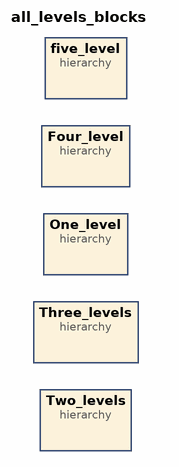
[diagram p0: block diagram of the top level]
# Vivado block design all_levels_blocks, xc7z020clg400-1, Vivado 2025.2
create_bd_design all_levels_blocks

create_bd_cell -type hier Three_levels
create_bd_cell -type hier Two_levels
create_bd_cell -type hier One_level
create_bd_cell -type hier Four_level
create_bd_cell -type hier five_level

# ---- hierarchy /Three_levels ----
current_bd_instance /Three_levels
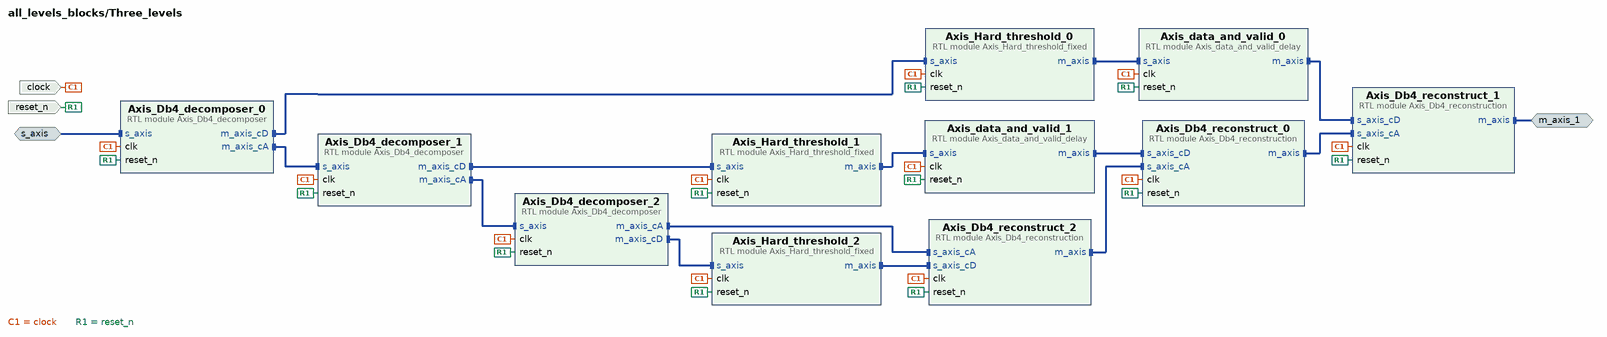
[diagram p1: block diagram inside /Three_levels]
create_bd_intf_pin -mode Slave -vlnv xilinx.com:interface:axis_rtl:1.0 s_axis
create_bd_intf_pin -mode Master -vlnv xilinx.com:interface:axis_rtl:1.0 m_axis_1
create_bd_pin -dir I -type clk clock
create_bd_pin -dir I -type rst reset_n

create_bd_cell -type module -reference Axis_Db4_decomposer Axis_Db4_decomposer_0
create_bd_cell -type module -reference Axis_data_and_valid_delay Axis_data_and_valid_0
set_property -dict {CONFIG.DATA_WIDTH 32 CONFIG.DELAY 74} [get_bd_cells Axis_data_and_valid_0]
create_bd_cell -type module -reference Axis_Db4_reconstruction Axis_Db4_reconstruct_0
set_property -dict {CONFIG.LEVEL 2} [get_bd_cells Axis_Db4_reconstruct_0]
create_bd_cell -type module -reference Axis_data_and_valid_delay Axis_data_and_valid_1
set_property -dict {CONFIG.DATA_WIDTH 32 CONFIG.DELAY 45} [get_bd_cells Axis_data_and_valid_1]
create_bd_cell -type module -reference Axis_Db4_decomposer Axis_Db4_decomposer_1
create_bd_cell -type module -reference Axis_Db4_decomposer Axis_Db4_decomposer_2
create_bd_cell -type module -reference Axis_Db4_reconstruction Axis_Db4_reconstruct_2
set_property -dict {CONFIG.LEVEL 3} [get_bd_cells Axis_Db4_reconstruct_2]
create_bd_cell -type module -reference Axis_Db4_reconstruction Axis_Db4_reconstruct_1
set_property -dict {CONFIG.LEVEL 1} [get_bd_cells Axis_Db4_reconstruct_1]
create_bd_cell -type module -reference Axis_Hard_threshold_fixed Axis_Hard_threshold_0
set_property -dict {CONFIG.THRESHOLD 5000} [get_bd_cells Axis_Hard_threshold_0]
create_bd_cell -type module -reference Axis_Hard_threshold_fixed Axis_Hard_threshold_1
set_property -dict {CONFIG.THRESHOLD 5000} [get_bd_cells Axis_Hard_threshold_1]
create_bd_cell -type module -reference Axis_Hard_threshold_fixed Axis_Hard_threshold_2
set_property -dict {CONFIG.THRESHOLD 5000} [get_bd_cells Axis_Hard_threshold_2]

# ---- hierarchy /Two_levels ----
current_bd_instance /Two_levels
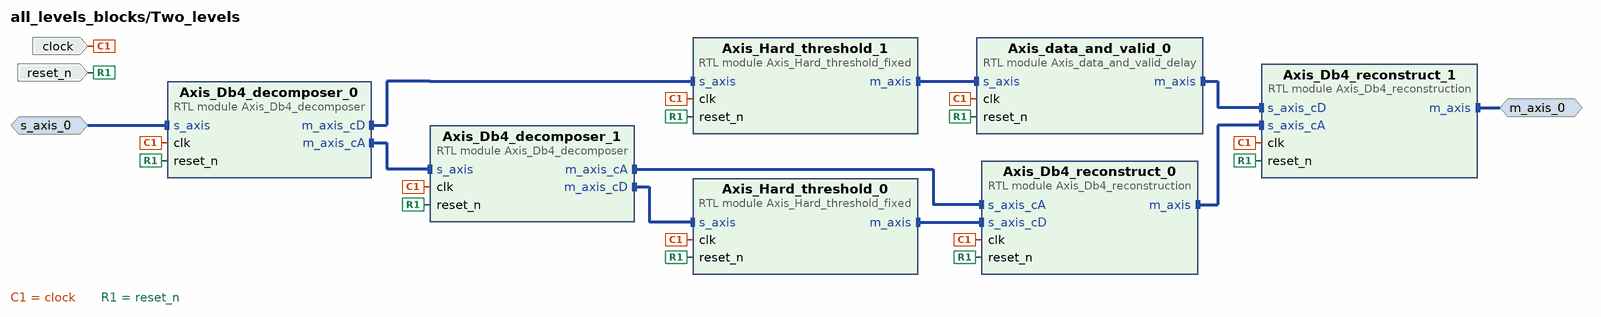
[diagram p2: block diagram inside /Two_levels]
create_bd_intf_pin -mode Slave -vlnv xilinx.com:interface:axis_rtl:1.0 s_axis_0
create_bd_intf_pin -mode Master -vlnv xilinx.com:interface:axis_rtl:1.0 m_axis_0
create_bd_pin -dir I clock
create_bd_pin -dir I -type rst reset_n

create_bd_cell -type module -reference Axis_Db4_decomposer Axis_Db4_decomposer_0
create_bd_cell -type module -reference Axis_data_and_valid_delay Axis_data_and_valid_0
set_property -dict {CONFIG.DATA_WIDTH 32 CONFIG.DELAY 29} [get_bd_cells Axis_data_and_valid_0]
create_bd_cell -type module -reference Axis_Db4_reconstruction Axis_Db4_reconstruct_0
set_property -dict {CONFIG.LEVEL 2} [get_bd_cells Axis_Db4_reconstruct_0]
create_bd_cell -type module -reference Axis_Db4_decomposer Axis_Db4_decomposer_1
create_bd_cell -type module -reference Axis_Db4_reconstruction Axis_Db4_reconstruct_1
set_property -dict {CONFIG.LEVEL 1} [get_bd_cells Axis_Db4_reconstruct_1]
create_bd_cell -type module -reference Axis_Hard_threshold_fixed Axis_Hard_threshold_0
set_property -dict {CONFIG.THRESHOLD 5000} [get_bd_cells Axis_Hard_threshold_0]
create_bd_cell -type module -reference Axis_Hard_threshold_fixed Axis_Hard_threshold_1
set_property -dict {CONFIG.THRESHOLD 5000} [get_bd_cells Axis_Hard_threshold_1]

# ---- hierarchy /One_level ----
current_bd_instance /One_level
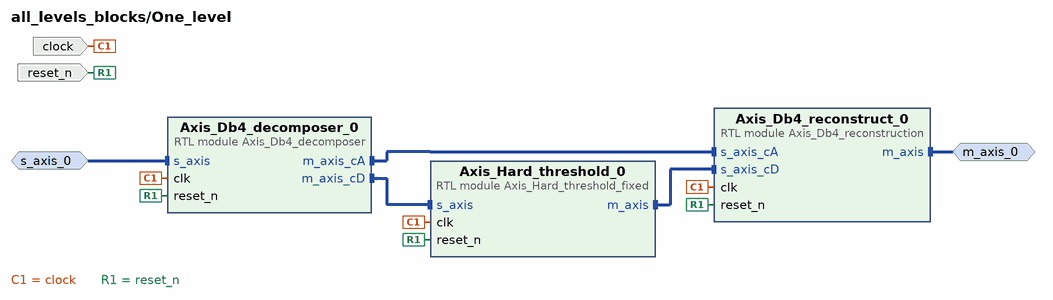
[diagram p3: block diagram inside /One_level]
create_bd_intf_pin -mode Slave -vlnv xilinx.com:interface:axis_rtl:1.0 s_axis_0
create_bd_intf_pin -mode Master -vlnv xilinx.com:interface:axis_rtl:1.0 m_axis_0
create_bd_pin -dir I clock
create_bd_pin -dir I -type rst reset_n

create_bd_cell -type module -reference Axis_Db4_decomposer Axis_Db4_decomposer_0
create_bd_cell -type module -reference Axis_Db4_reconstruction Axis_Db4_reconstruct_0
set_property -dict {CONFIG.LEVEL 1} [get_bd_cells Axis_Db4_reconstruct_0]
create_bd_cell -type module -reference Axis_Hard_threshold_fixed Axis_Hard_threshold_0
set_property -dict {CONFIG.THRESHOLD 5000} [get_bd_cells Axis_Hard_threshold_0]

# ---- hierarchy /Four_level ----
current_bd_instance /Four_level
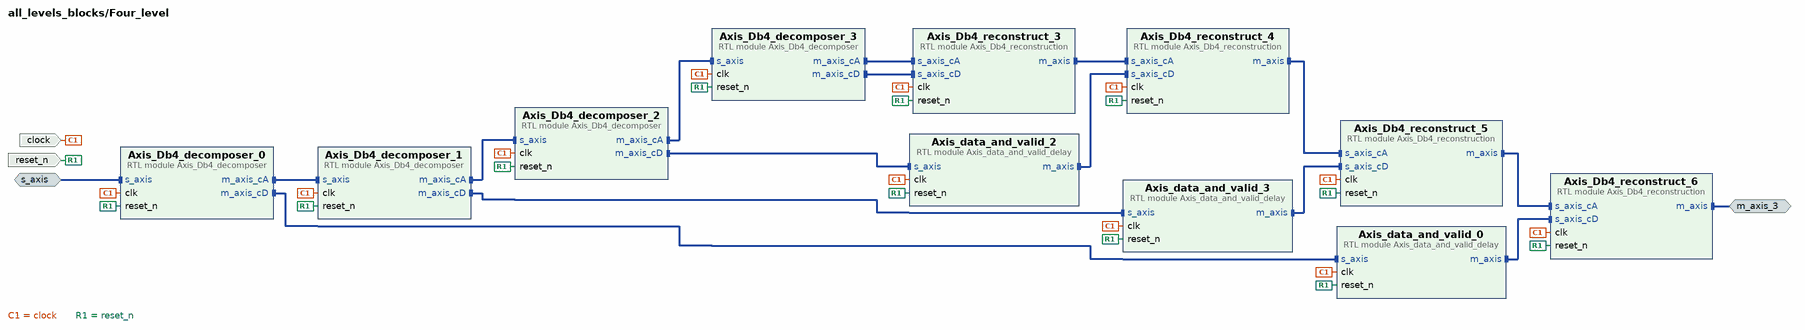
[diagram p4: block diagram inside /Four_level]
create_bd_intf_pin -mode Slave -vlnv xilinx.com:interface:axis_rtl:1.0 s_axis
create_bd_intf_pin -mode Master -vlnv xilinx.com:interface:axis_rtl:1.0 m_axis_3
create_bd_pin -dir I -type clk clock
create_bd_pin -dir I -type rst reset_n

create_bd_cell -type module -reference Axis_Db4_decomposer Axis_Db4_decomposer_0
create_bd_cell -type module -reference Axis_data_and_valid_delay Axis_data_and_valid_0
set_property -dict {CONFIG.DATA_WIDTH 32 CONFIG.DELAY 151} [get_bd_cells Axis_data_and_valid_0]
create_bd_cell -type module -reference Axis_Db4_decomposer Axis_Db4_decomposer_1
create_bd_cell -type module -reference Axis_Db4_decomposer Axis_Db4_decomposer_2
create_bd_cell -type module -reference Axis_Db4_decomposer Axis_Db4_decomposer_3
create_bd_cell -type module -reference Axis_Db4_reconstruction Axis_Db4_reconstruct_3
set_property -dict {CONFIG.LEVEL 4} [get_bd_cells Axis_Db4_reconstruct_3]
create_bd_cell -type module -reference Axis_data_and_valid_delay Axis_data_and_valid_2
set_property -dict {CONFIG.DATA_WIDTH 32 CONFIG.DELAY 77} [get_bd_cells Axis_data_and_valid_2]
create_bd_cell -type module -reference Axis_Db4_reconstruction Axis_Db4_reconstruct_4
set_property -dict {CONFIG.LEVEL 3} [get_bd_cells Axis_Db4_reconstruct_4]
create_bd_cell -type module -reference Axis_data_and_valid_delay Axis_data_and_valid_3
set_property -dict {CONFIG.DATA_WIDTH 32 CONFIG.DELAY 122} [get_bd_cells Axis_data_and_valid_3]
create_bd_cell -type module -reference Axis_Db4_reconstruction Axis_Db4_reconstruct_5
set_property -dict {CONFIG.LEVEL 2} [get_bd_cells Axis_Db4_reconstruct_5]
create_bd_cell -type module -reference Axis_Db4_reconstruction Axis_Db4_reconstruct_6
set_property -dict {CONFIG.LEVEL 1} [get_bd_cells Axis_Db4_reconstruct_6]

# ---- hierarchy /five_level ----
current_bd_instance /five_level
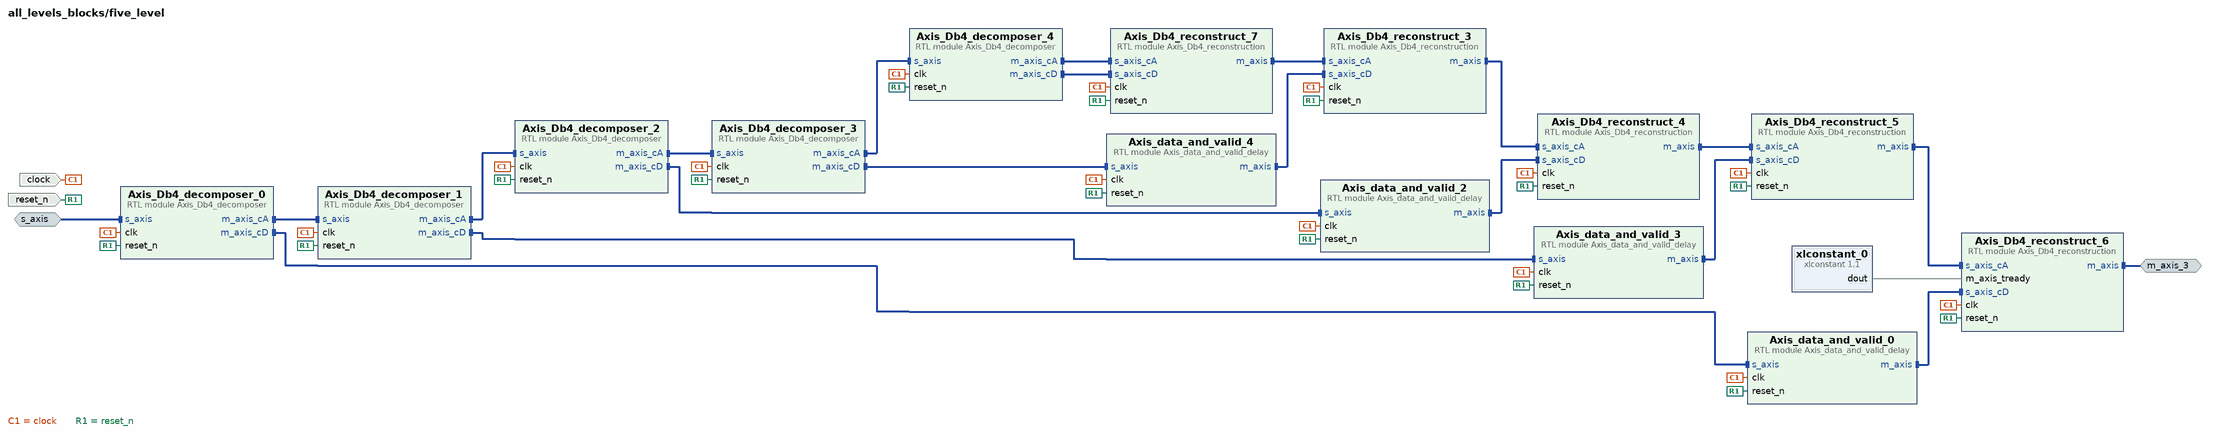
[diagram p5: block diagram inside /five_level]
create_bd_intf_pin -mode Slave -vlnv xilinx.com:interface:axis_rtl:1.0 s_axis
create_bd_intf_pin -mode Master -vlnv xilinx.com:interface:axis_rtl:1.0 m_axis_3
create_bd_pin -dir I -type clk clock
create_bd_pin -dir I -type rst reset_n

create_bd_cell -type module -reference Axis_Db4_decomposer Axis_Db4_decomposer_0
create_bd_cell -type module -reference Axis_data_and_valid_delay Axis_data_and_valid_0
set_property -dict {CONFIG.DATA_WIDTH 32 CONFIG.DELAY 292} [get_bd_cells Axis_data_and_valid_0]
create_bd_cell -type module -reference Axis_Db4_decomposer Axis_Db4_decomposer_1
create_bd_cell -type module -reference Axis_Db4_decomposer Axis_Db4_decomposer_2
create_bd_cell -type module -reference Axis_Db4_decomposer Axis_Db4_decomposer_3
create_bd_cell -type module -reference Axis_Db4_reconstruction Axis_Db4_reconstruct_3
set_property -dict {CONFIG.LEVEL 4} [get_bd_cells Axis_Db4_reconstruct_3]
create_bd_cell -type module -reference Axis_data_and_valid_delay Axis_data_and_valid_2
set_property -dict {CONFIG.DATA_WIDTH 32 CONFIG.DELAY 218} [get_bd_cells Axis_data_and_valid_2]
create_bd_cell -type module -reference Axis_Db4_reconstruction Axis_Db4_reconstruct_4
set_property -dict {CONFIG.LEVEL 3} [get_bd_cells Axis_Db4_reconstruct_4]
create_bd_cell -type module -reference Axis_data_and_valid_delay Axis_data_and_valid_3
set_property -dict {CONFIG.DATA_WIDTH 32 CONFIG.DELAY 263} [get_bd_cells Axis_data_and_valid_3]
create_bd_cell -type module -reference Axis_Db4_reconstruction Axis_Db4_reconstruct_5
set_property -dict {CONFIG.LEVEL 2} [get_bd_cells Axis_Db4_reconstruct_5]
create_bd_cell -type module -reference Axis_Db4_reconstruction Axis_Db4_reconstruct_6
set_property -dict {CONFIG.LEVEL 1} [get_bd_cells Axis_Db4_reconstruct_6]
create_bd_cell -type module -reference Axis_Db4_decomposer Axis_Db4_decomposer_4
create_bd_cell -type module -reference Axis_Db4_reconstruction Axis_Db4_reconstruct_7
set_property -dict {CONFIG.LEVEL 5} [get_bd_cells Axis_Db4_reconstruct_7]
create_bd_cell -type ip -vlnv xilinx.com:ip:xlconstant:1.1 xlconstant_0
create_bd_cell -type module -reference Axis_data_and_valid_delay Axis_data_and_valid_4
set_property -dict {CONFIG.DATA_WIDTH 32 CONFIG.DELAY 141} [get_bd_cells Axis_data_and_valid_4]

# ---- connections ----

current_bd_instance /Three_levels
connect_bd_intf_net [get_bd_intf_pins Axis_Db4_decomposer_0/m_axis_cA] [get_bd_intf_pins Axis_Db4_decomposer_1/s_axis]
connect_bd_intf_net [get_bd_intf_pins Axis_Db4_decomposer_0/m_axis_cD] [get_bd_intf_pins Axis_Hard_threshold_0/s_axis]
connect_bd_intf_net [get_bd_intf_pins Axis_Db4_decomposer_1/m_axis_cA] [get_bd_intf_pins Axis_Db4_decomposer_2/s_axis]
connect_bd_intf_net [get_bd_intf_pins Axis_Db4_decomposer_1/m_axis_cD] [get_bd_intf_pins Axis_Hard_threshold_1/s_axis]
connect_bd_intf_net [get_bd_intf_pins Axis_Db4_decomposer_2/m_axis_cA] [get_bd_intf_pins Axis_Db4_reconstruct_2/s_axis_cA]
connect_bd_intf_net [get_bd_intf_pins Axis_Db4_decomposer_2/m_axis_cD] [get_bd_intf_pins Axis_Hard_threshold_2/s_axis]
connect_bd_intf_net [get_bd_intf_pins Axis_Db4_reconstruct_0/m_axis] [get_bd_intf_pins Axis_Db4_reconstruct_1/s_axis_cA]
connect_bd_intf_net [get_bd_intf_pins m_axis_1] [get_bd_intf_pins Axis_Db4_reconstruct_1/m_axis]
connect_bd_intf_net [get_bd_intf_pins Axis_Db4_reconstruct_2/m_axis] [get_bd_intf_pins Axis_Db4_reconstruct_0/s_axis_cA]
connect_bd_intf_net [get_bd_intf_pins Axis_Hard_threshold_0/m_axis] [get_bd_intf_pins Axis_data_and_valid_0/s_axis]
connect_bd_intf_net [get_bd_intf_pins Axis_Hard_threshold_1/m_axis] [get_bd_intf_pins Axis_data_and_valid_1/s_axis]
connect_bd_intf_net [get_bd_intf_pins Axis_Hard_threshold_2/m_axis] [get_bd_intf_pins Axis_Db4_reconstruct_2/s_axis_cD]
connect_bd_intf_net [get_bd_intf_pins s_axis] [get_bd_intf_pins Axis_Db4_decomposer_0/s_axis]
connect_bd_intf_net [get_bd_intf_pins Axis_data_and_valid_0/m_axis] [get_bd_intf_pins Axis_Db4_reconstruct_1/s_axis_cD]
connect_bd_intf_net [get_bd_intf_pins Axis_data_and_valid_1/m_axis] [get_bd_intf_pins Axis_Db4_reconstruct_0/s_axis_cD]
connect_bd_net -net sim_clk_gen_0_clk [get_bd_pins clock] \
  [get_bd_pins Axis_Db4_decomposer_0/clk] [get_bd_pins Axis_Db4_decomposer_1/clk] [get_bd_pins Axis_Db4_decomposer_2/clk] \
  [get_bd_pins Axis_Db4_reconstruct_0/clk] [get_bd_pins Axis_Db4_reconstruct_1/clk] [get_bd_pins Axis_Db4_reconstruct_2/clk] \
  [get_bd_pins Axis_Hard_threshold_0/clk] [get_bd_pins Axis_Hard_threshold_1/clk] [get_bd_pins Axis_Hard_threshold_2/clk] \
  [get_bd_pins Axis_data_and_valid_0/clk] [get_bd_pins Axis_data_and_valid_1/clk]
connect_bd_net -net sim_clk_gen_0_sync_rst [get_bd_pins reset_n] \
  [get_bd_pins Axis_Db4_decomposer_0/reset_n] [get_bd_pins Axis_Db4_decomposer_1/reset_n] \
  [get_bd_pins Axis_Db4_decomposer_2/reset_n] [get_bd_pins Axis_Db4_reconstruct_0/reset_n] \
  [get_bd_pins Axis_Db4_reconstruct_1/reset_n] [get_bd_pins Axis_Db4_reconstruct_2/reset_n] \
  [get_bd_pins Axis_Hard_threshold_0/reset_n] [get_bd_pins Axis_Hard_threshold_1/reset_n] \
  [get_bd_pins Axis_Hard_threshold_2/reset_n] [get_bd_pins Axis_data_and_valid_0/reset_n] \
  [get_bd_pins Axis_data_and_valid_1/reset_n]

current_bd_instance /Two_levels
connect_bd_intf_net [get_bd_intf_pins Axis_Db4_decomposer_1/s_axis] [get_bd_intf_pins Axis_Db4_decomposer_0/m_axis_cA]
connect_bd_intf_net [get_bd_intf_pins Axis_Db4_decomposer_0/m_axis_cD] [get_bd_intf_pins Axis_Hard_threshold_1/s_axis]
connect_bd_intf_net [get_bd_intf_pins Axis_Db4_decomposer_1/m_axis_cA] [get_bd_intf_pins Axis_Db4_reconstruct_0/s_axis_cA]
connect_bd_intf_net [get_bd_intf_pins Axis_Db4_decomposer_1/m_axis_cD] [get_bd_intf_pins Axis_Hard_threshold_0/s_axis]
connect_bd_intf_net [get_bd_intf_pins Axis_Db4_reconstruct_0/m_axis] [get_bd_intf_pins Axis_Db4_reconstruct_1/s_axis_cA]
connect_bd_intf_net [get_bd_intf_pins Axis_Hard_threshold_0/m_axis] [get_bd_intf_pins Axis_Db4_reconstruct_0/s_axis_cD]
connect_bd_intf_net [get_bd_intf_pins Axis_Hard_threshold_1/m_axis] [get_bd_intf_pins Axis_data_and_valid_0/s_axis]
connect_bd_intf_net [get_bd_intf_pins Axis_data_and_valid_0/m_axis] [get_bd_intf_pins Axis_Db4_reconstruct_1/s_axis_cD]
connect_bd_intf_net [get_bd_intf_pins Axis_Db4_decomposer_0/s_axis] [get_bd_intf_pins s_axis_0]
connect_bd_intf_net [get_bd_intf_pins Axis_Db4_reconstruct_1/m_axis] [get_bd_intf_pins m_axis_0]
connect_bd_net [get_bd_pins clock] \
  [get_bd_pins Axis_Db4_decomposer_0/clk] [get_bd_pins Axis_Db4_decomposer_1/clk] [get_bd_pins Axis_Db4_reconstruct_0/clk] \
  [get_bd_pins Axis_Db4_reconstruct_1/clk] [get_bd_pins Axis_Hard_threshold_0/clk] [get_bd_pins Axis_Hard_threshold_1/clk] \
  [get_bd_pins Axis_data_and_valid_0/clk]
connect_bd_net [get_bd_pins reset_n] \
  [get_bd_pins Axis_Db4_decomposer_0/reset_n] [get_bd_pins Axis_Db4_decomposer_1/reset_n] \
  [get_bd_pins Axis_Db4_reconstruct_0/reset_n] [get_bd_pins Axis_Db4_reconstruct_1/reset_n] \
  [get_bd_pins Axis_Hard_threshold_0/reset_n] [get_bd_pins Axis_Hard_threshold_1/reset_n] \
  [get_bd_pins Axis_data_and_valid_0/reset_n]

current_bd_instance /One_level
connect_bd_intf_net [get_bd_intf_pins Axis_Db4_decomposer_0/m_axis_cA] [get_bd_intf_pins Axis_Db4_reconstruct_0/s_axis_cA]
connect_bd_intf_net [get_bd_intf_pins Axis_Db4_decomposer_0/m_axis_cD] [get_bd_intf_pins Axis_Hard_threshold_0/s_axis]
connect_bd_intf_net [get_bd_intf_pins m_axis_0] [get_bd_intf_pins Axis_Db4_reconstruct_0/m_axis]
connect_bd_intf_net [get_bd_intf_pins Axis_Hard_threshold_0/m_axis] [get_bd_intf_pins Axis_Db4_reconstruct_0/s_axis_cD]
connect_bd_intf_net [get_bd_intf_pins Axis_Db4_decomposer_0/s_axis] [get_bd_intf_pins s_axis_0]
connect_bd_net [get_bd_pins clock] \
  [get_bd_pins Axis_Hard_threshold_0/clk] [get_bd_pins Axis_Db4_decomposer_0/clk] [get_bd_pins Axis_Db4_reconstruct_0/clk]
connect_bd_net [get_bd_pins reset_n] \
  [get_bd_pins Axis_Hard_threshold_0/reset_n] [get_bd_pins Axis_Db4_decomposer_0/reset_n] \
  [get_bd_pins Axis_Db4_reconstruct_0/reset_n]

current_bd_instance /Four_level
connect_bd_intf_net [get_bd_intf_pins Axis_Db4_decomposer_0/m_axis_cA] [get_bd_intf_pins Axis_Db4_decomposer_1/s_axis]
connect_bd_intf_net [get_bd_intf_pins Axis_Db4_decomposer_0/m_axis_cD] [get_bd_intf_pins Axis_data_and_valid_0/s_axis]
connect_bd_intf_net [get_bd_intf_pins Axis_Db4_decomposer_1/m_axis_cA] [get_bd_intf_pins Axis_Db4_decomposer_2/s_axis]
connect_bd_intf_net [get_bd_intf_pins Axis_Db4_decomposer_1/m_axis_cD] [get_bd_intf_pins Axis_data_and_valid_3/s_axis]
connect_bd_intf_net [get_bd_intf_pins Axis_Db4_decomposer_2/m_axis_cA] [get_bd_intf_pins Axis_Db4_decomposer_3/s_axis]
connect_bd_intf_net [get_bd_intf_pins Axis_Db4_decomposer_2/m_axis_cD] [get_bd_intf_pins Axis_data_and_valid_2/s_axis]
connect_bd_intf_net [get_bd_intf_pins Axis_Db4_decomposer_3/m_axis_cA] [get_bd_intf_pins Axis_Db4_reconstruct_3/s_axis_cA]
connect_bd_intf_net [get_bd_intf_pins Axis_Db4_decomposer_3/m_axis_cD] [get_bd_intf_pins Axis_Db4_reconstruct_3/s_axis_cD]
connect_bd_intf_net [get_bd_intf_pins Axis_Db4_reconstruct_3/m_axis] [get_bd_intf_pins Axis_Db4_reconstruct_4/s_axis_cA]
connect_bd_intf_net [get_bd_intf_pins Axis_Db4_reconstruct_4/m_axis] [get_bd_intf_pins Axis_Db4_reconstruct_5/s_axis_cA]
connect_bd_intf_net [get_bd_intf_pins Axis_Db4_reconstruct_5/m_axis] [get_bd_intf_pins Axis_Db4_reconstruct_6/s_axis_cA]
connect_bd_intf_net [get_bd_intf_pins s_axis] [get_bd_intf_pins Axis_Db4_decomposer_0/s_axis]
connect_bd_intf_net [get_bd_intf_pins Axis_data_and_valid_0/m_axis] [get_bd_intf_pins Axis_Db4_reconstruct_6/s_axis_cD]
connect_bd_intf_net [get_bd_intf_pins Axis_data_and_valid_2/m_axis] [get_bd_intf_pins Axis_Db4_reconstruct_4/s_axis_cD]
connect_bd_intf_net [get_bd_intf_pins Axis_data_and_valid_3/m_axis] [get_bd_intf_pins Axis_Db4_reconstruct_5/s_axis_cD]
connect_bd_intf_net [get_bd_intf_pins Axis_Db4_reconstruct_6/m_axis] [get_bd_intf_pins m_axis_3]
connect_bd_net -net sim_clk_gen_0_clk [get_bd_pins clock] \
  [get_bd_pins Axis_Db4_decomposer_0/clk] [get_bd_pins Axis_Db4_decomposer_1/clk] [get_bd_pins Axis_Db4_decomposer_2/clk] \
  [get_bd_pins Axis_Db4_decomposer_3/clk] [get_bd_pins Axis_Db4_reconstruct_3/clk] [get_bd_pins Axis_Db4_reconstruct_4/clk] \
  [get_bd_pins Axis_Db4_reconstruct_5/clk] [get_bd_pins Axis_Db4_reconstruct_6/clk] [get_bd_pins Axis_data_and_valid_0/clk] \
  [get_bd_pins Axis_data_and_valid_2/clk] [get_bd_pins Axis_data_and_valid_3/clk]
connect_bd_net -net sim_clk_gen_0_sync_rst [get_bd_pins reset_n] \
  [get_bd_pins Axis_Db4_decomposer_0/reset_n] [get_bd_pins Axis_Db4_decomposer_1/reset_n] \
  [get_bd_pins Axis_Db4_decomposer_2/reset_n] [get_bd_pins Axis_Db4_decomposer_3/reset_n] \
  [get_bd_pins Axis_Db4_reconstruct_3/reset_n] [get_bd_pins Axis_Db4_reconstruct_4/reset_n] \
  [get_bd_pins Axis_Db4_reconstruct_5/reset_n] [get_bd_pins Axis_Db4_reconstruct_6/reset_n] \
  [get_bd_pins Axis_data_and_valid_0/reset_n] [get_bd_pins Axis_data_and_valid_2/reset_n] \
  [get_bd_pins Axis_data_and_valid_3/reset_n]

current_bd_instance /five_level
connect_bd_intf_net [get_bd_intf_pins Axis_Db4_decomposer_0/m_axis_cA] [get_bd_intf_pins Axis_Db4_decomposer_1/s_axis]
connect_bd_intf_net [get_bd_intf_pins Axis_Db4_decomposer_0/m_axis_cD] [get_bd_intf_pins Axis_data_and_valid_0/s_axis]
connect_bd_intf_net [get_bd_intf_pins Axis_Db4_decomposer_1/m_axis_cA] [get_bd_intf_pins Axis_Db4_decomposer_2/s_axis]
connect_bd_intf_net [get_bd_intf_pins Axis_Db4_decomposer_1/m_axis_cD] [get_bd_intf_pins Axis_data_and_valid_3/s_axis]
connect_bd_intf_net [get_bd_intf_pins Axis_Db4_decomposer_2/m_axis_cA] [get_bd_intf_pins Axis_Db4_decomposer_3/s_axis]
connect_bd_intf_net [get_bd_intf_pins Axis_Db4_decomposer_2/m_axis_cD] [get_bd_intf_pins Axis_data_and_valid_2/s_axis]
connect_bd_intf_net [get_bd_intf_pins Axis_Db4_decomposer_3/m_axis_cA] [get_bd_intf_pins Axis_Db4_decomposer_4/s_axis]
connect_bd_intf_net [get_bd_intf_pins Axis_Db4_decomposer_3/m_axis_cD] [get_bd_intf_pins Axis_data_and_valid_4/s_axis]
connect_bd_intf_net [get_bd_intf_pins Axis_Db4_decomposer_4/m_axis_cA] [get_bd_intf_pins Axis_Db4_reconstruct_7/s_axis_cA]
connect_bd_intf_net [get_bd_intf_pins Axis_Db4_decomposer_4/m_axis_cD] [get_bd_intf_pins Axis_Db4_reconstruct_7/s_axis_cD]
connect_bd_intf_net [get_bd_intf_pins Axis_Db4_reconstruct_3/m_axis] [get_bd_intf_pins Axis_Db4_reconstruct_4/s_axis_cA]
connect_bd_intf_net [get_bd_intf_pins Axis_Db4_reconstruct_4/m_axis] [get_bd_intf_pins Axis_Db4_reconstruct_5/s_axis_cA]
connect_bd_intf_net [get_bd_intf_pins Axis_Db4_reconstruct_5/m_axis] [get_bd_intf_pins Axis_Db4_reconstruct_6/s_axis_cA]
connect_bd_intf_net [get_bd_intf_pins Axis_Db4_reconstruct_7/m_axis] [get_bd_intf_pins Axis_Db4_reconstruct_3/s_axis_cA]
connect_bd_intf_net [get_bd_intf_pins s_axis] [get_bd_intf_pins Axis_Db4_decomposer_0/s_axis]
connect_bd_intf_net [get_bd_intf_pins Axis_data_and_valid_0/m_axis] [get_bd_intf_pins Axis_Db4_reconstruct_6/s_axis_cD]
connect_bd_intf_net [get_bd_intf_pins Axis_data_and_valid_2/m_axis] [get_bd_intf_pins Axis_Db4_reconstruct_4/s_axis_cD]
connect_bd_intf_net [get_bd_intf_pins Axis_data_and_valid_3/m_axis] [get_bd_intf_pins Axis_Db4_reconstruct_5/s_axis_cD]
connect_bd_intf_net [get_bd_intf_pins Axis_data_and_valid_4/m_axis] [get_bd_intf_pins Axis_Db4_reconstruct_3/s_axis_cD]
connect_bd_intf_net [get_bd_intf_pins Axis_Db4_reconstruct_6/m_axis] [get_bd_intf_pins m_axis_3]
connect_bd_net -net sim_clk_gen_0_clk [get_bd_pins clock] \
  [get_bd_pins Axis_Db4_decomposer_0/clk] [get_bd_pins Axis_Db4_decomposer_1/clk] [get_bd_pins Axis_Db4_decomposer_2/clk] \
  [get_bd_pins Axis_Db4_decomposer_3/clk] [get_bd_pins Axis_Db4_decomposer_4/clk] [get_bd_pins Axis_Db4_reconstruct_3/clk] \
  [get_bd_pins Axis_Db4_reconstruct_4/clk] [get_bd_pins Axis_Db4_reconstruct_5/clk] [get_bd_pins Axis_Db4_reconstruct_6/clk] \
  [get_bd_pins Axis_Db4_reconstruct_7/clk] [get_bd_pins Axis_data_and_valid_0/clk] [get_bd_pins Axis_data_and_valid_2/clk] \
  [get_bd_pins Axis_data_and_valid_3/clk] [get_bd_pins Axis_data_and_valid_4/clk]
connect_bd_net -net sim_clk_gen_0_sync_rst [get_bd_pins reset_n] \
  [get_bd_pins Axis_Db4_decomposer_0/reset_n] [get_bd_pins Axis_Db4_decomposer_1/reset_n] \
  [get_bd_pins Axis_Db4_decomposer_2/reset_n] [get_bd_pins Axis_Db4_decomposer_3/reset_n] \
  [get_bd_pins Axis_Db4_decomposer_4/reset_n] [get_bd_pins Axis_Db4_reconstruct_3/reset_n] \
  [get_bd_pins Axis_Db4_reconstruct_4/reset_n] [get_bd_pins Axis_Db4_reconstruct_5/reset_n] \
  [get_bd_pins Axis_Db4_reconstruct_6/reset_n] [get_bd_pins Axis_Db4_reconstruct_7/reset_n] \
  [get_bd_pins Axis_data_and_valid_0/reset_n] [get_bd_pins Axis_data_and_valid_2/reset_n] \
  [get_bd_pins Axis_data_and_valid_3/reset_n] [get_bd_pins Axis_data_and_valid_4/reset_n]
connect_bd_net [get_bd_pins xlconstant_0/dout] [get_bd_pins Axis_Db4_reconstruct_6/m_axis_tready]

validate_bd_design
save_bd_design
